# EAGLE design Blackfoot (EAGLE 8.5.1)

## Sheet 1 of 2
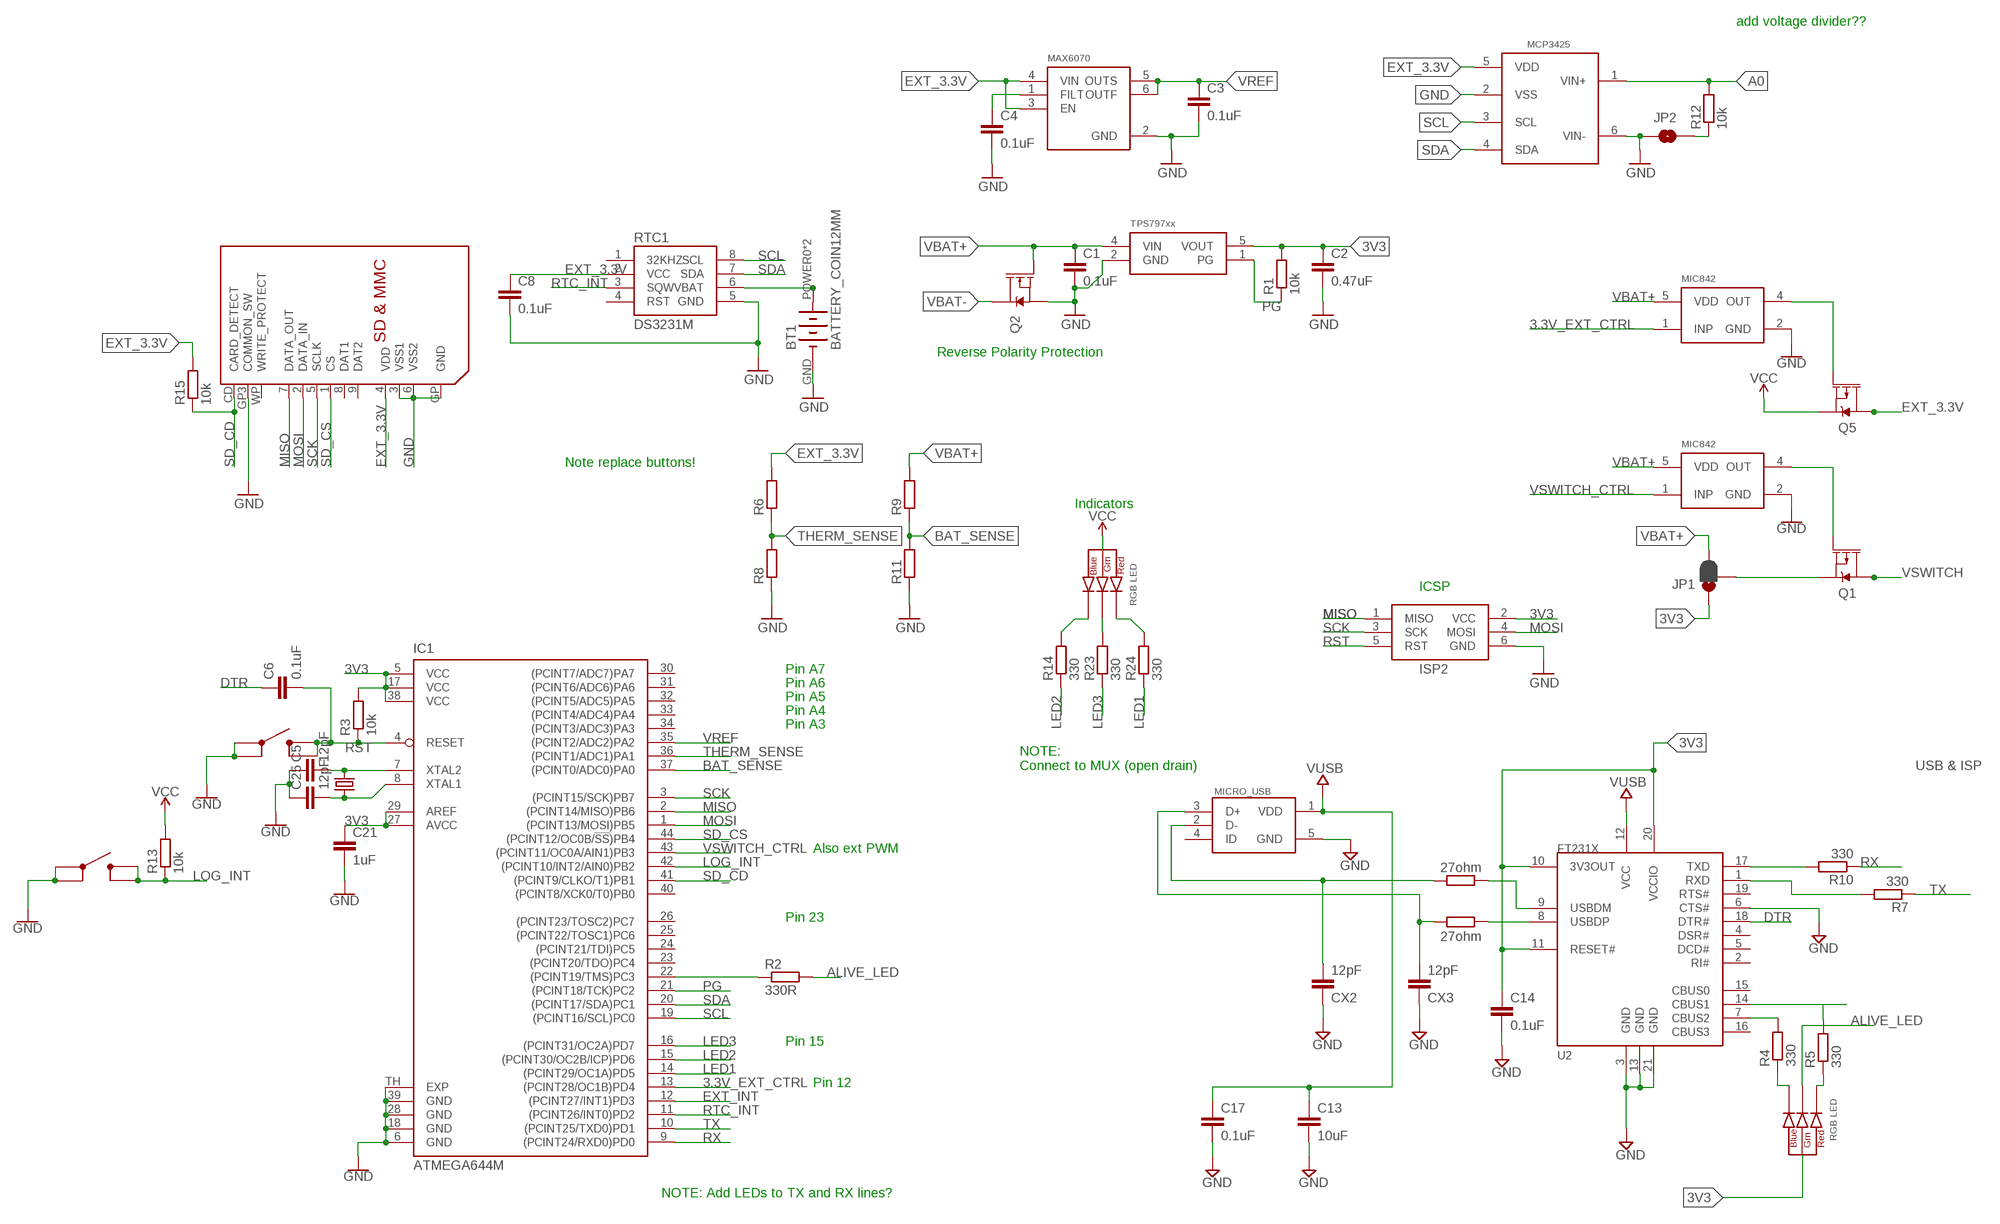
[diagram p0: schematic, sheet 1]

### Parts
BT1  BATTERY_COIN12MM  [AWICKERT_LINX_BAT-HLD-012-SMT]
C1  0.1uF  C-EUC0603  [C0603]
C2  0.47uF  C-EUC0603  [C0603]
C3  0.1uF  C-EUC0603  [C0603]
C4  0.1uF  C-EUC0603  [C0603]
C5  12pF  C-EU12PFC0603  [C0603]
C6  0.1uF  C-EU0.1UFC0603  [C0603]
C8  0.1uF  C-EUC0603  [C0603]
C13  10uF  C-EU10UFC0805  [C0805]
C14  0.1uF  C-EU0.1UFC0603  [C0603]
C17  0.1uF  C-EU0.1UFC0603  [C0603]
C21  1uF  C-EU1UFC0603  [C0603]
C25  12pF  C-EU12PFC0603  [C0603]
CX2  12pF  C-EU12PFC0603  [C0603]
CX3  12pF  C-EU12PFC0603  [C0603]
D+  27ohm  R-EU_27R0603  [R0603]
D-  27ohm  R-EU_27R0603  [R0603]
IC1  ATMEGA644M  [MLF44-TH]
ISP2  AVRISP-6  [AVRISP]
JP1  JUMPER-SMT_3_1-NC_PASTE_SILK  [SMT-JUMPER_3_1-NC_PASTE_SILK]
JP2  JUMPER-SMT_2_NO_SILK  [SMT-JUMPER_2_NO_SILK]
MICRO_USB  MICRO_USB_LONGPADS  [10118194-0001LF_10118194-0001LF_LONGER_PADS]
Q1  MOSFET_PCH-IRLML2244  [SOT23-3]
Q2  MOSFET-NCH-DMG3404L  [SOT23-3]
Q5  MOSFET_PCH-IRLML2244  [SOT23-3]
R1  10k  R-EU_R0603  [R0603]
R2  330R  R-EU_R0603  [R0603]
R3  10k  R-EU_10KR0603  [R0603]
R4  330  R-EU_330R0603  [R0603]
R5  330  R-EU_330R0603  [R0603]
R6  R-EU_R0603  [R0603]
R7  330  R-EU_330R0603  [R0603]
R8  R-EU_R0603  [R0603]
R9  R-EU_R0603  [R0603]
R10  330  R-EU_330R0603  [R0603]
R11  R-EU_R0603  [R0603]
R12  10k  R-EU_R0603  [R0603]
R13  10k  R-EU_10KR0603  [R0603]
R14  330  R-EU_330R0603  [R0603]
R15  10k  R-EU_R0603  [R0603]
R23  330  R-EU_330R0603  [R0603]
R24  330  R-EU_330R0603  [R0603]
RTC1  DS3231M  [SO08]
U2  FT231X-Q  [QFN20]
U$1  CRYSTAL_5X3.2_2LEAD  [CRYSTAL_5X3.2_2-SMD]
U$3  SDMMC06132  [06132]
U$4  MIC842  [DCK_R-PDSO-G5]
U$5  BUTTON4.2X3.2  [SWITCH_4.2X3.2]
U$6  TPS79733  [DCK_R-PDSO-G5]
U$7  MAX6070AAUT18  [SOT23-6L]
U$8  MCP3425  [SOT23-6L]
U$9  BUTTON4.2X3.2  [SWITCH_4.2X3.2]
U$15  CLVBA-FKA  [CLVBA-FKA]
U$16  CLVBA-FKA  [CLVBA-FKA]
U$18  MIC842  [DCK_R-PDSO-G5]

### Nets
3.3V_EXT_CTRL: IC1.13((PCINT28/OC1B)PD4) U$18.1(INP)
3V3: C2.1 C14.1 C21.1 IC1.5(VCC) IC1.17(VCC) IC1.27(AVCC) IC1.29(AREF) IC1.38(VCC) ISP2.2(VCC) JP1.1 Q5.2(S) R1.2 R3.2 R13.2 U2.10(3V3OUT) U2.11(RESET#) U2.20(VCCIO) U$6.5(VOUT) U$15.2(ANODE) U$16.2(ANODE) ; supply symbol labelled VCC
A0: R12.2 U$8.1(VIN+) ; also sheet 2
ALIVE_LED: R2.2 U$16.4(GREEN_CATH)
BAT_SENSE: IC1.37((PCINT0/ADC0)PA0) R9.1 R11.2
DTR: C6.1 U2.18(DTR#)
EXT_3.3V: C8.1 Q5.3(D) R6.2 R15.2 RTC1.2(VCC) U$3.4(VDD) U$7.3(EN) U$7.4(VIN) U$8.5(VDD) ; also sheet 2
EXT_INT: IC1.12((PCINT27/INT1)PD3) ; also sheet 2
GND: BT1.GND(-) C1.2 C2.2 C3.2 C4.2 C5.1 C8.2 C13.2 C14.2 C17.2 C21.2 C25.1 CX2.1 CX3.1 IC1.6(GND) IC1.18(GND) IC1.28(GND) IC1.39(GND) IC1.TH(EXP) ISP2.6(GND) JP2.1 MICRO_USB.5(GND) Q2.2(S) R8.1 R11.1 RTC1.5(GND) U2.3(GND) U2.6(CTS#) U2.13(GND) U2.21(GND) U$3.3(VSS1) U$3.6(VSS2) U$3.GP3(COMMON_SW) U$3.GP(GND) U$4.2(GND) U$5.1 U$5.2 U$6.2(GND) U$7.2(GND) U$8.2(VSS) U$8.6(VIN-) U$9.1 U$9.2 U$18.2(GND) ; also sheet 2
LED1: IC1.14((PCINT29/OC1A)PD5) R24.1
LED2: IC1.15((PCINT30/OC2B/ICP)PD6) R14.1
LED3: IC1.16((PCINT31/OC2A)PD7) R23.1
LOG_INT: IC1.42((PCINT10/INT2/AIN0)PB2) R13.1 U$5.3 U$5.4
MISO: IC1.2((PCINT14/MISO)PB6) ISP2.1(MISO) U$3.7(DATA_OUT) ; also sheet 2
MOSI: IC1.1((PCINT13/MOSI)PB5) ISP2.4(MOSI) U$3.2(DATA_IN) ; also sheet 2
N$1: IC1.22((PCINT19/TMS)PC3) R2.1
N$2: Q1.1(G) U$4.4(OUT)
N$3: JP1.2 Q1.2(S)
N$5: C5.2 IC1.7(XTAL2) U$1.OSC2
N$7: Q5.1(G) U$18.4(OUT)
N$8: C25.2 IC1.8(XTAL1) U$1.OSC1
N$9: R14.2 U$15.3(BLUE_CATH)
N$10: R23.2 U$15.4(GREEN_CATH)
N$11: C4.1 U$7.1(FILT)
N$13: JP2.2 R12.1
N$15: R24.2 U$15.1(RED_CATH)
N$16: R5.1 U$16.1(RED_CATH)
N$25: R10.2 U2.17(TXD)
N$26: R4.1 U$16.3(BLUE_CATH)
N$31: BT1.POWER0(+) BT1.POWER1(+) RTC1.6(VBAT)
N$35: R7.2 U2.1(RXD)
N$36: CX3.2 D+.2 MICRO_USB.3(D+)
N$37: CX2.2 D-.2 MICRO_USB.2(D-)
N$38: D+.1 U2.8(USBDP)
N$41: R4.2 U2.7(CBUS2)
N$43: R5.2 U2.14(CBUS1)
N$46: D-.1 U2.9(USBDM)
PG: IC1.21((PCINT18/TCK)PC2) R1.1 U$6.1(PG)
RST: C6.2 IC1.4(RESET) ISP2.5(RST) R3.1 U$9.3 U$9.4
RTC_INT: IC1.11((PCINT26/INT0)PD2) RTC1.3(SQW)
RX: IC1.9((PCINT24/RXD0)PD0) R10.1
SCK: IC1.3((PCINT15/SCK)PB7) ISP2.3(SCK) U$3.5(SCLK) ; also sheet 2
SCL: IC1.19((PCINT16/SCL)PC0) RTC1.8(SCL) U$8.3(SCL) ; also sheet 2
SD_CD: IC1.41((PCINT9/CLKO/T1)PB1) R15.1 U$3.CD(CARD_DETECT)
SD_CS: IC1.44((PCINT12/OC0B/!SS!)PB4) U$3.1(CS)
SDA: IC1.20((PCINT17/SDA)PC1) RTC1.7(SDA) U$8.4(SDA) ; also sheet 2
THERM_SENSE: IC1.36((PCINT1/ADC1)PA1) R6.1 R8.2
TX: IC1.10((PCINT25/TXD0)PD1) R7.1
VBAT+: C1.1 JP1.3 Q2.1(G) R9.2 U$4.5(VDD) U$6.4(VIN) U$18.5(VDD) ; also sheet 2
VBAT-: Q2.3(D) ; also sheet 2
VREF: C3.1 IC1.35((PCINT2/ADC2)PA2) U$7.5(OUTS) U$7.6(OUTF) ; also sheet 2
VSWITCH: Q1.3(D) ; also sheet 2
VSWITCH_CTRL: IC1.43((PCINT11/OC0A/AIN1)PB3) U$4.1(INP)
VUSB: C13.1 C17.1 MICRO_USB.1(VDD) U2.12(VCC)
Unconnected: IC1.23((PCINT20/TDO)PC4) IC1.24((PCINT21/TDI)PC5) IC1.25((PCINT22/TOSC1)PC6) IC1.26((PCINT23/TOSC2)PC7) IC1.30((PCINT7/ADC7)PA7) IC1.31((PCINT6/ADC6)PA6) IC1.32((PCINT5/ADC5)PA5) IC1.33((PCINT4/ADC4)PA4) IC1.34((PCINT3/ADC3)PA3) IC1.40((PCINT8/XCK0/T0)PB0) MICRO_USB.4(ID) RTC1.1(32KHZ) RTC1.4(RST) U2.2(RI#) U2.4(DSR#) U2.5(DCD#) U2.15(CBUS0) U2.16(CBUS3) U2.19(RTS#) U$3.8(DAT1) U$3.9(DAT2) U$3.WP(WRITE_PROTECT)

### Notes on the sheet
- add voltage divider??
- Reverse Polarity Protection
- Note replace buttons!
- Indicators
- ICSP
- Pin A7
- Pin A6
- Pin A5
- Pin A4
- Pin A3
- NOTE:
  Connect to MUX (open drain)
- USB & ISP
- Also ext PWM
- Pin 23
- Pin 15
- Pin 12
- NOTE: Add LEDs to TX and RX lines?

## Sheet 2 of 2
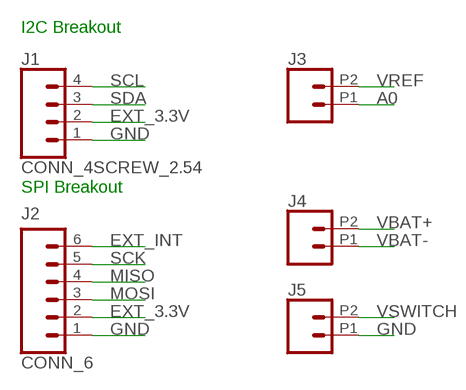
[diagram p1: schematic, sheet 2]

### Parts
J1  CONN_4SCREW_2.54  [1X04]
J2  CONN_6  [1X06_SCREW]
J3  CONN_022.54MM_SCREWTERM  [1X02_2.54_SCREWTERM]
J4  CONN_022.54MM_SCREWTERM  [1X02_2.54_SCREWTERM]
J5  CONN_022.54MM_SCREWTERM  [1X02_2.54_SCREWTERM]

### Nets
A0: J3.P1 ; also sheet 1
EXT_3.3V: J1.2 J2.2 ; also sheet 1
EXT_INT: J2.6 ; also sheet 1
GND: J1.1 J2.1 J5.P1 ; also sheet 1
MISO: J2.4 ; also sheet 1
MOSI: J2.3 ; also sheet 1
SCK: J2.5 ; also sheet 1
SCL: J1.4 ; also sheet 1
SDA: J1.3 ; also sheet 1
VBAT+: J4.P2 ; also sheet 1
VBAT-: J4.P1 ; also sheet 1
VREF: J3.P2 ; also sheet 1
VSWITCH: J5.P2 ; also sheet 1

### Notes on the sheet
- I2C Breakout
- SPI Breakout

## Library data of the parts
BT1 = bschulz:BATTERY_COIN: Coin Cell Battery Holder; DIGIKEY: BAT-HLD-012-SMT-ND; MF: Linx; MPN: BAT-HLD-012-SMT
C1-C4 = bschulz_passives:C-EU: CAPACITOR, European symbol
C5 C25 CX2 CX3 = bschulz:C-EU: CAPACITOR, European symbol; DIGIKEY: 1276-1254-1-ND; MF: Samsung; MPN: CL10C120JB8NNNC
C6 C14 C17 = bschulz:C-EU: CAPACITOR, European symbol; DIGIKEY: 1276-1005-1-ND; MF: Samsung; MPN: CL10B104KO8NNNC
C8 = bschulz:C-EU: CAPACITOR, European symbol
C13 = bschulz:C-EU: CAPACITOR, European symbol; DIGIKEY: 1276-2405-1-ND; MF: Samsung; MPN: CL21A106KQCLRNC
C21 = bschulz:C-EU: CAPACITOR, European symbol; DIGIKEY: 1276-6524-1-ND; MF: Samsung; MPN: CL10B105MO8NNWC
D+ D- = bschulz:R-EU_: RESISTOR, European symbol; DIGIKEY: 311-27.0HRCT-ND; MF: Yageo; MPN: RC0603FR-0727RL; VALUE_PART: 27
IC1 = bschulz:ATMEGA644*: 8-bit Microcontroller with 64K Bytes In-System Programmable Flash Source: http://www.atmel.com/dyn/resources/prod_documents/doc2593.pdf; DIGIKEY: ATMEGA644PA-MURCT-ND; MF: Atmel; MPN: ATMEGA644PA-MUR; OC_FARNELL: 1748528; OC_NEWARK: 26R5636
ISP2 = bschulz:AVRISP: AVR ISP HEADER Standard 6 pin header for AVR programming; DIGIKEY: 609-3234-ND; MF: Amphenol; MPN: 67997-206HLF
J1 = bschulz:CONN_4: Genaric 4 pin connector
J2 = bschulz:CONN_6: Genaric 6 pin header
J3-J5 = bschulz:CONN_02: Multi connection point. Often used as Generic Header-pin footprint for 0.1 inch spaced/style header connections On any of the 0.1 inch spaced packages, you can populate with these: Break Away Headers - Straight <https://www.sparkfun.com/products/116> (PRT-00116) Break Away Male Headers - Right Angle <https://www.sparkfun.com/products/553> (PRT-00553) Female Headers <https://www.sparkfun.com/products/115> (PRT-00115) Break Away Headers - Machine Pin <https://www.sparkfun.com/products/117> (PRT-00117) Break Away Female Headers - Swiss Machine Pin <https://www.sparkfun.com/products/743> (PRT-00743) For SCREWTERMINALS and SPRING TERMINALS visit here: Screw Terimnals on SparkFun.com <https://www.sparkfun.com/search/results?term=Screw+Terminals> (5mm/3.5mm/2.54mm spacing) This device is also useful as a general connection point to wire up your design to another part of your project. Our various solder wires solder well into these plated through hole pads. Hook-Up Wire - Assortment (Stranded, 22 AWG) <https://www.sparkfun.com/products/11375> (PRT-11375) Hook-Up Wire - Assortment (Solid Core, 22 AWG) <https://www.sparkfun.com/products/11367> (PRT-11367) View the entire wire category on our website here <https://www.sparkfun.com/categories/141> Special notes: Molex polarized connector foot print use with: PRT-08233 with associated crimp pins and housings. 2.54_SCREWTERM for use with PRT-10571. 3.5mm Screw Terminal footprints for PRT-08084 5mm Screw Terminal footprints for use with PRT-08432
JP1 = SparkFun-Jumpers:JUMPER-SMT_3_1-NC_PASTE: Normally closed solder jumper (1 of 2 connections) This jumper has an aperture in the stencil to allow solder paste to bridge one of the two connections. One connection is normally closed (NC), while the other is normally open (NO). Wick off the solder to open the connection. Reapply solder to reclose the connection. Apply solder to the other side instead to change the current path.
JP2 = SparkFun-Jumpers:JUMPER-SMT_2_NO: Normally open jumper This jumper has two pads in close proximity to each other. Apply solder to close the connection. Round pads are easier to solder for beginners, but are a lot larger. SparkFun Product that uses the round pads: SparkFun EL Sequencer <https://www.sparkfun.com/products/12781>
MICRO_USB = bschulz:MICRO_USB_LONGPADS
Q1 Q5 = bschulz:MOSFET_PCH: P-channel MOSFETs Voltage controlled devices that allow control of high current outputs. SparkFun Products: SparkFun ESP32 Thing <https://www.sparkfun.com/products/13907> SparkFun ESP8266 Thing <https://www.sparkfun.com/products/13231>; DIGIKEY: FDN360PCT-ND; MF: Fairchild; MPN: FDN360P
Q2 = bschulz:MOSFET-NCH: N-channel MOSFETs Voltage controlled devices that allow control of high current outputs. SparkFun Products: SparkFun OpenScale <https://www.sparkfun.com/products/13261> SparkFun Digital Sandbox <https://www.sparkfun.com/products/12651> SparkFun Monster Moto Shield <https://www.sparkfun.com/products/10182> SparkFun MOSFET Power Controller <https://www.sparkfun.com/products/11214>
R1 R2 R6 R8 R9 R11 R12 R15 = bschulz:R-EU_: RESISTOR, European symbol
R3 R13 = bschulz:R-EU_: RESISTOR, European symbol; DIGIKEY: 311-10.0KHRCT-ND; MF: Yageo; MPN: RC0603FR-0710KL; VALUE_PART: 10k
R4 R5 R7 R10 R14 R23 R24 = bschulz:R-EU_: RESISTOR, European symbol; DIGIKEY: 311-330HRCT-ND; MF: Yageo; MPN: RC0603FR-07330RL; VALUE_PART: 330
RTC1 = bschulz:DS3231M: DS3231M Real Time Clock Accuracy +/-5ppm. Battery Backup. 2.3V to 5.5V. Datasheet <https://cdn.sparkfun.com/datasheets/Dev/Beagle/DS3231M.pdf> SparkFun Products CryptoCape <https://www.sparkfun.com/products/12773> (DEV-12773) SparkFun CryptoShield <https://www.sparkfun.com/products/13183> (DEV-13183); DIGIKEY: DS3231MZ+-ND; MF: Maxim; MPN: DS3231MZ+
U2 = bschulz:FT231X: FT231x - USB to UART Bridge Characteristics: Vin: 3.3V ~ 5V Operating Temperature: -40°C to 85°C Digikey: FT231x <https://www.digikey.com/product-detail/en/ftdi-future-technology-devices-international-ltd/FT231XQ-R/768-1128-1-ND/3029153>; DIGIKEY: 768-1128-1-ND; MF: FTDI; MPN: FT231XQ-R
U$1 = bschulz:CRYSTAL_5X3.2_2LEAD: TXC Crystal, 5 x 3.2mm, SMD, 2 Lead 8 MHz PN = 887-2634-1-ND
U$3 = adafruit:SDMMC: SD MMC Card holder 4UCON part #06132 - easy to solder
U$4 U$18 = bschulz:MIC842: Comparator with internal voltage referance (1.24V), 5V and 3.3V compatable, 20mA output current
U$5 U$9 = bschulz:BUTTON: Genaric SPST Pushbutton
U$6 = bschulz:TPS797*: TPS797xx, Ultra low power linear voltage regulator, fixed voltages of 1.8v, 3v, 3.3v Input voltage rage of 1.8-5.5v; DIGIKEY: 296-11990-1-ND; MF: TI; MPN: TPS79733DCKR
U$7 = bschulz:MAX6070AAUT*: MAX6070 Low Noise high precision voltage referance; DIGIKEY: MAX6070BAUT18+TCT-ND; MF: Maxim; MPN: MAX6070BAUT18+T
U$8 = bschulz:MCP3425: MCP3425 - Sigma Delta ADC Characteristics: VCC: 2.7~5.5V Operating Temperature: -40°C to 125°C Number of Inputs: 1 (Differenital) Sample Rate: 15 Samples Per Second Number of Bits: 16 Digikey: MCP3425A0T-E/CHCT-ND <https://www.digikey.com/product-detail/en/microchip-technology/MCP3425A0T-E-CH/MCP3425A0T-E-CHCT-ND/1979810>; DIGIKEY: MCP3425A0T-E/CHCT-ND; MF: Microchip; MPN: MCP3425A0T-E/CH
U$15 U$16 = bschulz:CLVBA-FKA: Cree RGB LED, Small Package, Common Anode, CLVBA-FKA Digikey: https://www.digikey.com/product-detail/en/cree-inc/CLVBA-FKA-CAEDH8BBB7A363/CLVBA-FKA-CAEDH8BBB7A363CT-ND/2650500; DIGIKEY: CLVBA-FKA-CAEDH8BBB7A363CT-ND; MF: Cree; MPN: CLVBA-FKA-CAEDH8BBB7A363

## Board
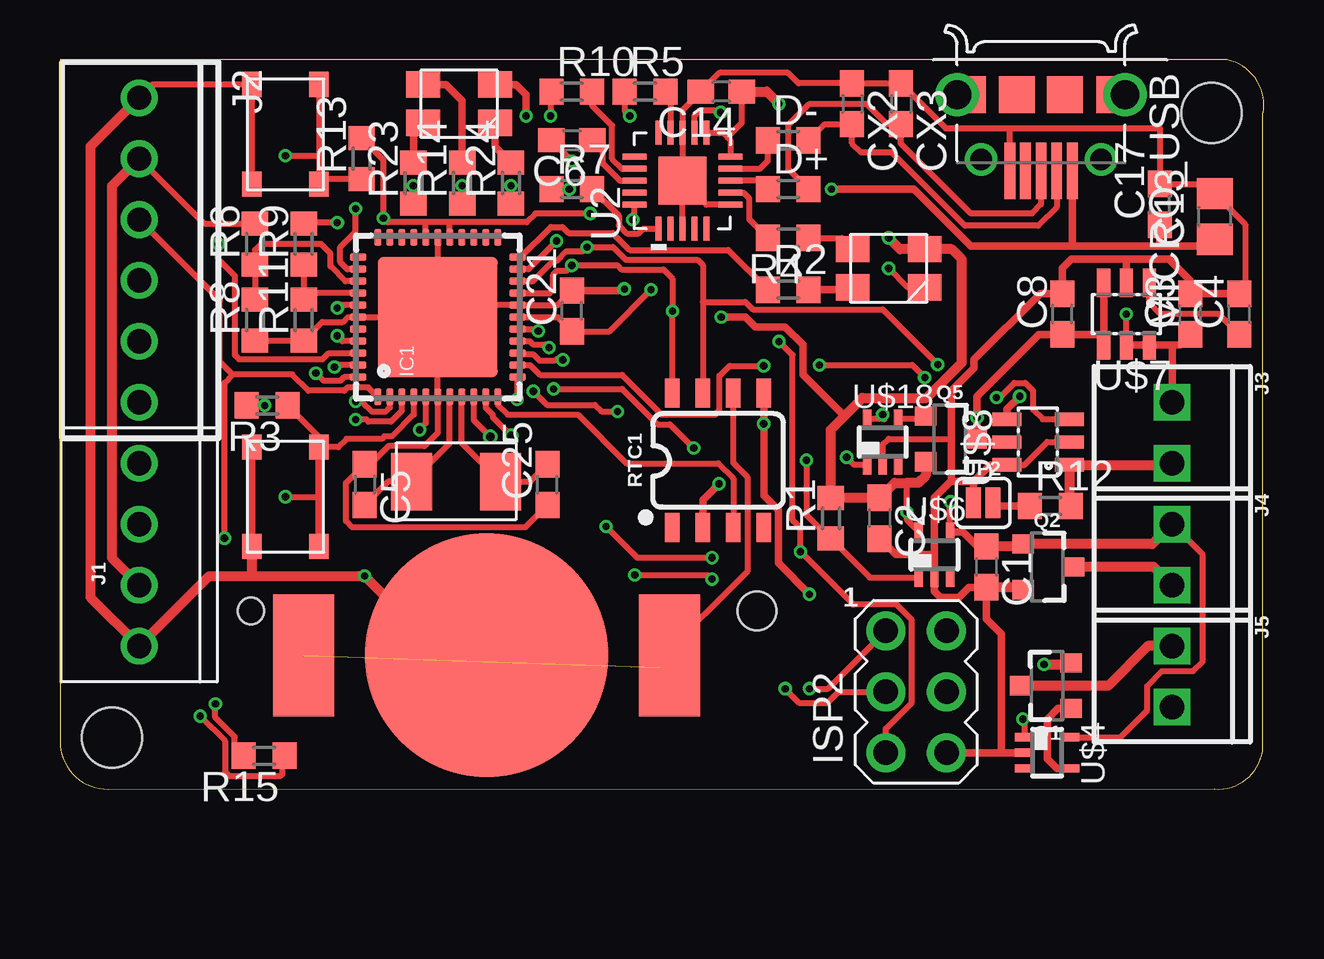
[diagram p2: board, top side]
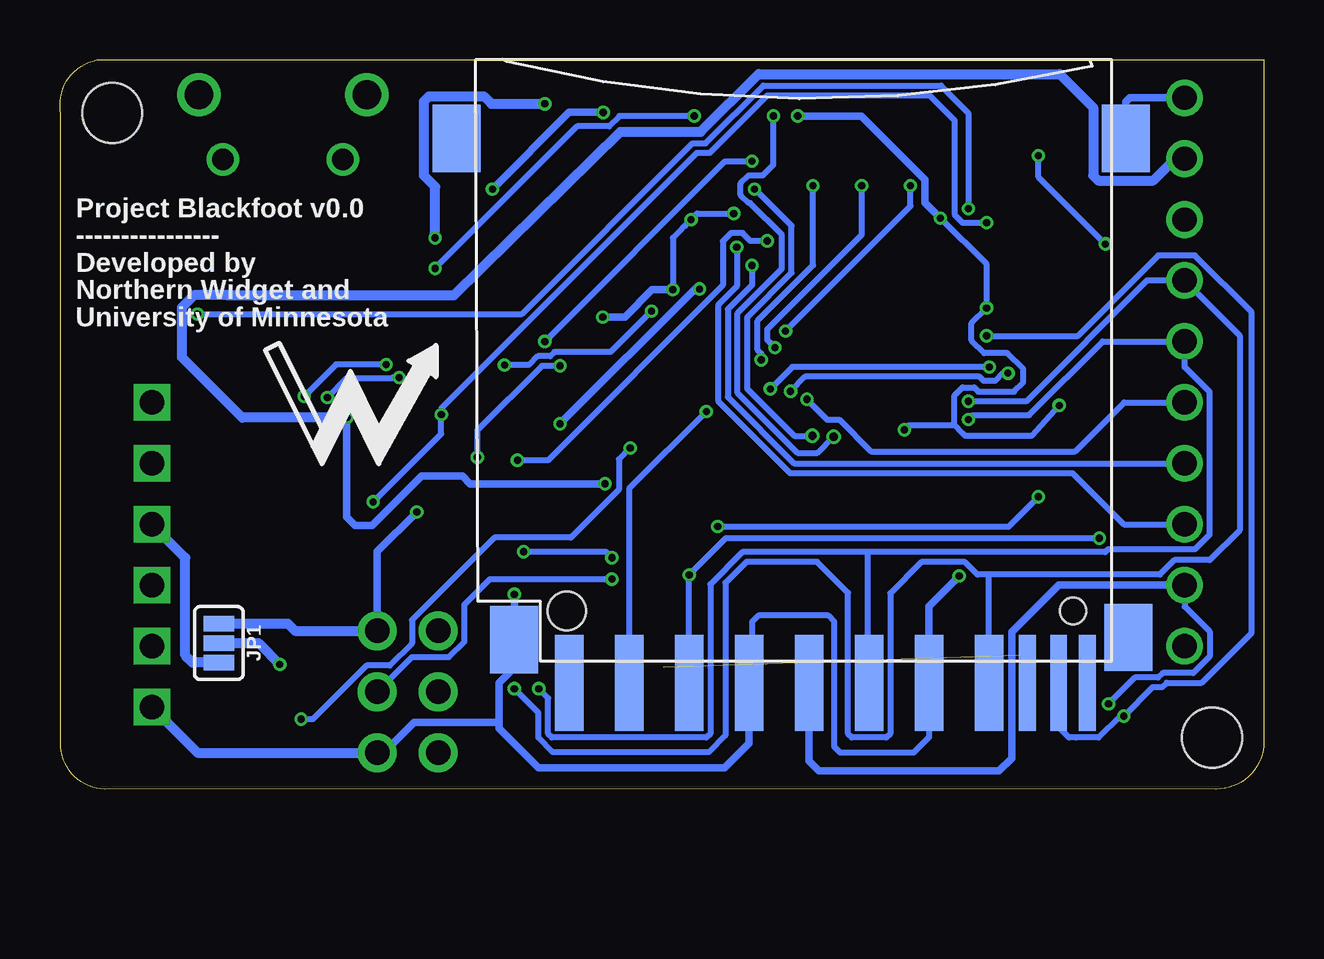
[diagram p3: board, bottom side, seen from below]

Size 50.18 x 30.4 mm. Coordinates in mm from the lower left corner, seen from the top.
Outline: 0,30.4 0,2 arc90 2,0 48.13,0.01 arc90 50.15,1.76 50.15,28.15 arc90 48.65,30.4 0,30.4
Copper layers (1*16): Top 0.035559375mm / dielectric 1.6mm / Bottom 0.035559375mm
Design rules "BayArea-2layer *": minimum track width 6mil, minimum drill 10mil, track to track 6mil, track to pad 6mil, pad to pad 6mil, via to via 6mil, smd to smd 6mil, copper to edge 15mil, drill to drill 6mil, minimum pad ring 5mil, minimum via ring 5mil, stop-mask expansion 2.5mil, vias tented up to drill 0mil, thermal gap 10mil
Holes 2.5 mm at 2.16,2.16 48.01,28.19
tKeepout: area 0.4,0.4 to 3.9,3.9; area 46.2,26.4 to 49.8,30

### Footprints (pad centres in the part's own frame; a part is rotated, then mirrored left to right if it is on the bottom)
AWICKERT_LINX_BAT-HLD-012-SMT = smd 10.16 x 10.16: GND 0,0 | smd 2.54 x 5.08: POWER0 -7.62,0; POWER1 7.62,0
C0603 = smd 1.1 x 1: 1 -0.85,0; 2 0.85,0
C0805 = smd 1.3 x 1.5: 1 -0.95,0; 2 0.95,0
R0603 = smd 1 x 1.1: 1 -0.85,0; 2 0.85,0
MLF44-TH = smd 0.7 x 0.3: 1 -3.325,2.5; 2 -3.325,2; 3 -3.325,1.5; 4 -3.325,1; 5 -3.325,0.5; 6 -3.325,0; 7 -3.325,-0.5; 8 -3.325,-1; 9 -3.325,-1.5; 10 -3.325,-2; 11 -3.325,-2.5; 23 3.325,-2.5; 24 3.325,-2; 25 3.325,-1.5; 26 3.325,-1; 27 3.325,-0.5; 28 3.325,0; 29 3.325,0.5; 30 3.325,1; 31 3.325,1.5; 32 3.325,2; 33 3.325,2.5 | smd 0.3 x 0.7: 12 -2.5,-3.325; 13 -2,-3.325; 14 -1.5,-3.325; 15 -1,-3.325; 16 -0.5,-3.325; 17 0,-3.325; 18 0.5,-3.325; 19 1,-3.325; 20 1.5,-3.325; 21 2,-3.325; 22 2.5,-3.325; 34 2.5,3.325; 35 2,3.325; 36 1.5,3.325; 37 1,3.325; 38 0.5,3.325; 39 0,3.325; 40 -0.5,3.325; 41 -1,3.325; 42 -1.5,3.325; 43 -2,3.325; 44 -2.5,3.325 | smd 5 x 5: TH 0,0
AVRISP = drill 1.02 pad 1.626: 1 -1.27,2.54; 2 1.27,2.54; 3 -1.27,0; 4 1.27,0; 5 -1.27,-2.54; 6 1.27,-2.54
1X04 = drill 1.016: 1 -3.81,0; 2 -1.27,0; 3 1.27,0; 4 3.81,0
1X06_SCREW = drill 1.016: 1 -6.35,0; 2 -3.81,0; 3 -1.27,0; 4 1.27,0; 5 3.81,0; 6 6.35,0
1X02_2.54_SCREWTERM = drill 1.016 square: P1 2.54,0; P2 0,0
SMT-JUMPER_3_1-NC_PASTE_SILK = smd 0.635 x 1.27: 1 -0.813,0; 2 0,0; 3 0.813,0
SMT-JUMPER_2_NO_SILK = smd 0.635 x 1.27: 1 -0.406,0; 2 0.406,0
10118194-0001LF_10118194-0001LF_LONGER_PADS = smd 0.45 x 2.35: 1 -1.3,3.175; 2 -0.65,3.175; 3 0,3.175; 4 0.65,3.175; 5 1.3,3.175 | drill 0.9: P$6 -2.5,2.7; P$7 2.5,2.7 | drill 1.2: P$8 -3.5,0; P$9 3.5,0 | smd 1.5 x 1.55: P$10 -1,0; P$11 1,0; P$12 -3.05,0; P$13 3.05,0
SOT23-3 = smd 0.8 x 0.9: 1 -0.95,-1; 2 0.95,-1; 3 0,1.1
SO08 = smd 0.6 x 1.2: 1 -1.905,-2.8; 2 -0.635,-2.8; 3 0.635,-2.8; 4 1.905,-2.8; 5 1.905,2.8; 6 0.635,2.8; 7 -0.635,2.8; 8 -1.905,2.8
QFN20 = smd 1 x 0.25: 1 -2.032,0.968; 2 -2.032,0.468; 3 -2.032,-0.032; 4 -2.032,-0.532; 5 -2.032,-1.032; 11 1.968,-1.032; 12 1.968,-0.532; 13 1.968,-0.032; 14 1.968,0.468; 15 1.968,0.968 | smd 0.25 x 1: 6 -1.032,-2.032; 7 -0.532,-2.032; 8 -0.032,-2.032; 9 0.468,-2.032; 10 0.968,-2.032; 16 0.968,1.968; 17 0.468,1.968; 18 -0.032,1.968; 19 -0.532,1.968; 20 -1.032,1.968 | smd 2 x 2: 21 -0.032,-0.032
CRYSTAL_5X3.2_2-SMD = smd 1.7 x 2.4: OSC1 -1.85,0; OSC2 1.85,0
06132 = smd 1.2 x 4: 1 6.9,0.9; 2 4.4,0.9; 3 1.9,0.9; 4 -0.6,0.9; 5 -3.1,0.9; 6 -5.6,0.9; 7 -8.1,0.9; 9 9.4,0.9 | smd 0.7 x 4: 8 -9.7,0.9; CD -11,0.9; WP -12.2,0.9 | smd 2 x 2.8: GP -13.8,-21.8; GP2 14.1,-21.8; GP3 11.7,-0.9; GP4 -13.9,-1 | hole 1.1: -11.6,-2.1 | hole 1.6: 9.5,-2.1
DCK_R-PDSO-G5 = smd 0.35 x 0.8: 1 -0.65,-0.95; 2 0,-0.95; 3 0.65,-0.95; 4 0.65,0.95; 5 -0.65,0.95
SWITCH_4.2X3.2 = smd 1.05 x 0.812: 1 -2.075,1.4; 2 2.075,1.4; 3 -2.075,-1.4; 4 2.075,-1.4
SOT23-6L = smd 0.55 x 1.2: 1 -0.95,-1.3; 2 0,-1.3; 3 0.95,-1.3; 4 0.95,1.3; 5 0,1.3; 6 -0.95,1.3
CLVBA-FKA = smd 1.4 x 1.1: 1 -1.5,0.8; 2 -1.5,-0.8; 3 1.5,-0.8; 4 1.5,0.8

### Placement (x,y rotation side)
BT1  17.78,5.59 180 top
C1  38.61,9.27 270 top
C2  34.16,11.3 270 top
C3  47.12,19.81 90 top
C4  49.15,19.81 90 top
C5  12.7,12.7 270 top
C6  21.34,27.05 180 top
C8  41.78,19.81 90 top
C13  48.13,23.88 90 top
C14  27.56,29.08 180 top
C17  45.85,24.38 90 top
C21  21.34,19.94 90 top
C25  20.32,12.7 90 top
CX2  33.02,28.57 270 top
CX3  35.05,28.57 270 top
D+  30.35,25.02 0 top
D-  30.35,27.05 0 top
IC1  15.75,19.68 90 top
ISP2  35.69,4.06 0 top
J1  3.3,9.78 90 top
J2  3.3,22.48 270 top
J3  46.35,16.13 270 top
J4  46.35,11.05 270 top
J5  46.35,5.97 270 top
JP1  43.56,6.1 270 bottom
JP2  38.48,11.94 0 top
MICRO_USB  40.89,28.96 180 top
Q1  41.15,4.32 90 top
Q2  41.15,9.27 270 top
Q5  37.08,14.61 270 top
R1  32.13,11.3 90 top
R2  30.35,20.83 0 top
R3  8.64,16 180 top
R4  30.35,22.99 180 top
R5  24.38,29.08 0 top
R6  8.13,22.73 90 top
R7  21.34,25.02 0 top
R8  8.13,19.56 90 top
R9  10.16,22.73 90 top
R10  21.34,29.08 0 top
R11  10.16,19.56 90 top
R12  41.27,11.81 0 top
R13  12.57,26.29 90 top
R14  16.76,25.27 90 top
R15  8.51,1.4 180 top
R23  14.73,25.27 90 top
R24  18.8,25.27 90 top
RTC1  27.43,13.72 0 top
U2  25.91,25.4 90 top
U$1  16.51,12.83 180 top
U$2  [NWLOGO_MED]  38.1,16.51 0 bottom
U$3  19.56,5.33 180 bottom
U$4  41.15,1.52 270 top
U$5  9.4,27.3 90 top
U$6  36.45,9.78 0 top
U$7  44.45,19.81 180 top
U$8  40.77,14.48 90 top
U$9  9.4,12.19 90 top
U$15  16.64,28.57 180 top
U$16  34.54,21.72 180 top
U$18  34.29,14.48 0 top

### Tracks (layer width: path | path; a pad name or v marks a point on that pad's centre or on a via)
3.3V_EXT_CTRL  (via drill 0.3)
  Top 0.254: IC1.13 19.6,17.68 20.02,17.27 23.43,17.27 25.08,15.62 27.31,15.62 27.49,15.8 27.49,17.23 27.91,17.65 v29.34,17.65 | U$18.1 33.1,13.53 v32.79,13.84
  Bottom 0.254: v32.79,13.84 32.79,14.96 30.1,17.65 v29.34,17.65
3V3  (via drill 0.3)
  Top 0.254: U2.11 27.62,27.37 27.81,27.18 | 27.81,27.18 27.94,27.05 U2.10 | C14.1 28.41,27.77 27.81,27.18 | IC1.17 20.74,19.68 C21.1 22.9,19.09 v24.64,20.83 | IC1.38 11.68,20.18 v11.56,20.07 | R3.2 v8.53,16 | 15.24,23.64 13.66,23.64 v13.48,23.81 13.48,26.23 R13.2 | IC1.29 15.25,23.63 15.24,23.64 | v23.88,23.75 23.94,23.81 U2.20 | v22.1,24 19.82,24 19.46,23.64 16.26,23.64 | 16.26,23.64 15.24,23.64 | IC1.27 16.25,23.63 16.26,23.64 | U$6.5 35.31,11.22 v35.31,11.56 35.31,12.77 | IC1.5 15.25,15.25 v14.99,14.99
  Top 0.305: v19.43,28.07 19.43,28.96 19.01,29.38 U$15.2 | 32.7,15.56 30.96,17.3 30.96,18.53 30.22,19.28 28.98,19.28 28.57,19.68 v27.56,19.68
  Top 0.406: v34.54,22.99 35.01,22.52 U$16.2 37.17,22.52 37.59,22.1 37.59,17.78 36.12,16.31 33.45,16.31 32.7,15.56 32.13,15 R1.2 C2.1 34.78,12.77 35.31,12.77 35.77,12.77 36.08,13.09 Q5.2 | C14.1 29.46,29.08 v29.97,28.57
  Bottom 0.254: v8.53,16 9.68,14.73 12.45,14.73 12.55,14.84 12.56,14.84 12.9,15.18 | 12.9,15.18 12.9,16.41 12.56,16.76 12.08,16.76 11.9,16.58 10.41,16.58 10.03,16.96 10.03,17.53 10.68,18.18 11.66,18.18 12.19,18.72 12.19,19.43 v11.56,20.07 11.56,21.89 v13.48,23.81 | v14.99,14.99 14.79,15.18 12.9,15.18 | 24.13,23.5 v23.88,23.75 | v23.88,23.75 23.62,24 v22.1,24 | v23.88,23.75 24.64,22.99 v24.64,20.83
  Bottom 0.305: v35.31,11.56 36.96,9.91 ISP2.2 | v13.48,23.81 14.12,24.46 14.12,25.42 16.77,28.07 v19.43,28.07 | v27.56,19.68 26.64,19.68 25.5,20.83 v24.64,20.83
  Bottom 0.406: v29.97,28.57 32.2,28.57 32.51,28.89 34.8,28.89 35.01,28.68 35.01,25.59 34.54,25.12 v34.54,22.99 | JP1.1 40.69,6.91 40.39,6.6 ISP2.2
A0
  Top 0.406: R12.2 42.07,11.87 U$8.1 46.29,13.53 J3.P1
ALIVE_LED
  Top 0.305: R2.2 32.95,20.83 U$16.4
BAT_SENSE
  Top 0.254: R9.1 R11.2 10.44,20.68 IC1.37
DTR
  Top 0.254: C6.1 22.61,26.63 22.61,26.1 23.34,25.37 U2.18
EXT_3.3V  (via drill 0.3)
  Top 0.254: J2.2 6.01,23.58 R6.2 | R15.2 7.29,1.77 7.29,2.18 6.48,2.99 v6.48,3.56
  Top 0.305: U$7.3 43.5,19.05 | 43.5,19.05 U$7.4 | v27.46,12.73 26.8,12.06 RTC1.2 | U$8.5 38.31,14.48 38.23,14.56 | 38.23,14.56 Q5.3 | 38.23,14.56 v38.23,15.49 38.23,16.38 40.81,18.96 C8.1 43.41,18.96 43.5,19.05
  Top 0.406: J2.2 2.16,25.15 2.16,9.65 J1.2
  Bottom 0.254: v6.48,3.56 5.38,4.66 4.42,4.66 4.22,4.85 2.95,4.85 2.26,5.54 2.26,6.58 3.3,7.62 J1.2
  Bottom 0.305: J1.2 7.5,8.51 7.51,8.52 8.56,8.52 10.51,6.56 10.51,1.3 11.05,0.76 18.54,0.76 18.96,1.18 U$3.4 | v27.46,12.73 33.08,12.73 33.4,13.05 35.1,13.05 37.16,10.99 37.89,10.99 38.24,11.35 38.24,15 v38.23,15.49
  Bottom 0.406: J2.2 3.7,26.29 4.61,25.38 6.91,25.38 7.11,25.59 7.11,28.42 8.51,29.82 21.07,29.82 23.48,27.41 26.82,27.41 33.76,20.6 43.18,20.6 43.2,20.6 44.59,20.6 45.11,20.08 45.11,18.02 42.59,15.49 v38.23,15.49
EXT_INT  (via drill 0.3)
  Top 0.254: IC1.12 19.05,17.16 v19.05,16.26
  Bottom 0.254: J2.6 5.82,16.13 7.86,14.09 16.37,14.09 17.7,15.41 18.2,15.41 v19.05,16.26
GND  (via drill 0.3)
  Top 0.254: U$8.2 41.15,14.48 40.2,13.53 U$8.6 | U2.3 U2.21 | U2.6 26.94,24.37 U2.21 | U2.21 U2.13 25.94,28.31 C14.2 27.49,29.86 30.34,29.86 30.78,29.43 CX2.1 CX3.1 36.92,27.56 39.59,27.56 | 39.59,27.56 45.85,27.56 C17.2 47.73,25.23 C13.2 49.4,23.56 49.4,20.92 C4.2 | MICRO_USB.5 39.59,27.56 | C25.1 19.39,10.92 12.18,10.92 11.92,11.18 11.92,12.77 12.59,13.44 | 12.59,13.44 C5.1 | IC1.TH IC1.6 15.75,14.86 15.2,14.31 13.69,14.31 12.83,13.44 12.59,13.44 | IC1.TH 16.25,20.18 IC1.18 20.73,20.18 C21.2 | IC1.TH IC1.39 12,19.68 11.8,19.48 10.94,19.48 R11.1 R8.1 | IC1.28 IC1.TH | J2.1 3.85,29.38 U$5.2 U$5.1 | U$18.2 34.29,14.35 34.54,14.61 37.15,14.61
  Top 0.305: U$4.2 39.24,1.52 | 39.24,1.52 ISP2.6 | C4.2 C3.2 47.12,21.21 46.23,22.1 44.45,22.1 | 44.45,21.34 U$7.2 44.45,22.1 | U$9.2 U$9.1 | v31.24,8.13 29.94,9.43 29.94,11.64 29.34,12.25 v29.34,15.24 RTC1.5 | v23.52,20.86 23.46,20.79 C21.2 | 36.45,9.78 U$6.2 36.45,8.26 36.7,8 37.47,8 37.88,8.42 C1.2 38.61,7.11 39.24,6.48 39.24,1.52 | C2.2 34.84,9.78 36.45,9.78 | 36.45,9.78 36.45,12.16 37.12,12.83 | 38.08,12.83 JP2.1 | 37.12,12.83 38.08,12.83 | U$8.6 38.78,13.53 38.08,12.83 | 37.12,12.83 37.15,12.86 37.15,14.61 37.15,16.62 38.1,17.57 38.1,17.91 40.85,20.66 C8.2 41.78,21.72 42.16,22.1 44.45,22.1
  Top 0.406: J2.1 1.27,26.8 1.27,8 J1.1 6.22,8.89 8,8.89 | 8,8.89 v12.7,8.89 16,5.59 BT1.GND | U$9.1 8,8.89 | Q2.2 40.05,8.42 C1.2
  Bottom 0.254: U$3.6 13.96,2.17 14.61,1.52 17.65,1.52 17.91,1.78 17.91,6.99 18.16,7.24 21.07,7.24 21.33,6.98 21.33,4.56 U$3.3
  Bottom 0.305: J2.1 5.59,28.83 5.76,28.66 U$3.GP | 31.24,6.25 U$3.GP3 31.11,6.09 | 31.24,6.25 v31.24,8.13 | U$3.6 13.96,7.63 v12.7,8.89 | U$3.3 21.46,1.91 22.48,0.89 30.23,0.89 31.88,2.54 31.88,2.79 | ISP2.6 36.7,1.52 35.43,2.79 31.88,2.79 | 31.88,2.79 31.88,4.45 31.24,5.08 31.24,6.25 | v29.34,15.24 23.72,20.86 v23.52,20.86
  Bottom 0.406: J5.P1 44.45,1.52 ISP2.6
LED1  (via drill 0.3)
  Top 0.254: v18.8,25.17 R24.1 | v20.95,17.91 20.66,17.91 20.61,17.86 20,17.86 19.75,18.11 19.14,18.11 IC1.14
  Bottom 0.254: v20.95,17.91 20.95,18.17 21.11,18.32 21.11,19.53 18.8,21.84 v18.8,25.17
LED2  (via drill 0.3)
  Top 0.254: v16.76,25.17 R14.1 | IC1.15 19.57,18.68 19.71,18.55 20.25,18.55 v20.38,18.41
  Bottom 0.254: v20.38,18.41 20.7,18.73 20.7,19.18 16.76,23.11 v16.76,25.17
LED3  (via drill 0.3)
  Top 0.254: IC1.16 19.86,19.18 v19.94,19.1 | v14.73,25.17 R23.1
  Bottom 0.254: v19.94,19.1 14.73,24.31 v14.73,25.17
LOG_INT  (via drill 0.3)
  Top 0.254: v6.6,22.73 6.6,22.1 7.3,21.4 7.3,18.09 7.46,17.93 10.94,17.93 11.2,18.18 IC1.42 | R13.1 10.84,25.44 10.8,25.4 U$5.3 10.8,26.42 | U$5.4 10.8,26.42 | v9.4,26.42 10.8,26.42
  Bottom 0.254: v6.6,22.73 9.4,25.53 v9.4,26.42
MISO  (via drill 0.3)
  Top 0.254: v31.24,4.19 32,4.19 ISP2.1 | IC1.2 13.75,15.91 13.57,15.73 13.03,15.73 12.58,16.17 v12.32,16.17
  Bottom 0.254: v12.32,16.17 9.91,16.17 4.87,21.21 J2.4 1.02,18.92 1.02,10.79 2.26,9.55 3.73,9.55 4.33,8.95 11.43,8.95 | 11.43,8.95 11.94,8.95 12.46,9.47 14.28,9.47 15.58,8.17 15.58,2.32 15.74,2.15 17.17,2.15 17.34,2.32 17.34,8.19 18.62,9.48 21.57,9.48 22.45,8.6 22.45,2.24 23.14,1.55 29.64,1.55 30.24,2.15 30.24,3.19 v31.24,4.19 | 11.43,8.95 11.46,8.92 U$3.7
MOSI  (via drill 0.3)
  Top 0.254: 7.21,17.29 6.66,17.84 6.66,20.39 J2.3 | IC1.1 12.85,16.76 11.99,16.76 11.85,16.62 10.36,16.62 9.69,17.29 7.21,17.29 | v6.86,10.47 6.86,16.94 7.21,17.29 | v23.96,8.94 27.01,8.94 v27.18,8.76
  Bottom 0.254: U$3.2 v23.96,8.94 22.43,10.47 v6.86,10.47 | v27.18,8.76 32.26,8.76 33.33,7.7 33.33,6.15 33.97,5.51 35.51,5.51 ISP2.4
N$1
  Top 0.254: R2.1 27.85,22.48 23.75,22.48 23.04,23.19 21.2,23.19 20.94,23.44 20.46,23.44 19.2,22.18 IC1.22
N$2
  Top 0.305: U$4.4 41.54,0.87 41.15,1.27 41.15,2.92 41.59,3.37 Q1.1
N$3  (via drill 0.3)
  Top 0.305: 42.21,5.21 Q1.2
  Top 0.406: v41.02,5.21 42.21,5.21
  Bottom 0.406: JP1.2 41.91,6.1 v41.02,5.21
N$5
  Top 0.254: IC1.7 16.25,14.41 U$1.OSC2 13.68,12.83 C5.2
N$7
  Top 0.254: Q5.1 35.96,15.43 U$18.4
N$8
  Top 0.254: IC1.8 16.75,14.44 U$1.OSC1 19.6,12.83 C25.2
N$9
  Top 0.305: R14.2 16.76,28.7 16.09,29.38 U$15.3
N$10
  Top 0.305: R23.2 14.73,27.37 U$15.4
N$11
  Top 0.254: C4.1 48.3,19.81 45.85,19.81 45.4,20.26 U$7.1
N$13
  Top 0.305: R12.1 39.01,11.81 JP2.2
N$15
  Top 0.305: R24.2 18.14,26.78 U$15.1
N$16  (via drill 0.3)
  Top 0.254: R5.1 23.53,28.28 v23.75,28.07 | 35.98,20.79 U$16.1 35.34,20.92 v34.54,21.72
  Bottom 0.254: v23.75,28.07 26.86,28.07 27.3,27.64 28.62,27.64 v34.54,21.72
N$25
  Top 0.254: R10.2 22.19,28.5 23.02,27.67 23.02,26.27 23.42,25.87 U2.17
N$26
  Top 0.254: R4.1 32.57,22.99 U$16.3
N$31  (1 unrouted)
  Top 0.254: RTC1.6 28.07,13.61 28.65,13.03 28.65,9.09 25.02,5.46 25.02,5.08 BT1.POWER0
N$35
  Top 0.254: R7.2 23.3,23.91 23.3,23.51 23.64,23.17 24.12,23.17 24.32,23.37 U2.1
N$36
  Top 0.254: D+.2 30.35,25.87 30.35,27.69 31.22,28.55 33.64,28.55 34.47,27.73 CX3.2 | 35.05,28.07 CX3.2 | MICRO_USB.3 40.89,24.38 40.51,24 37.97,24 35.05,26.92 CX3.2
N$37
  Top 0.254: MICRO_USB.2 41.54,24.27 40.77,23.5 37.72,23.5 34.67,26.54 33.4,26.54 33.02,26.92 CX2.2 31.88,27.73 D-.2
N$38
  Top 0.254: D+.1 29.15,25.37 U2.8
N$41
  Top 0.254: U2.7 28.49,24.87 28.72,24.64 28.72,23.77 R4.2
N$43
  Top 0.254: R5.2 25.44,28.88 U2.14
N$46
  Top 0.254: U2.9 29.17,25.87 29.5,26.2 D-.1
PG  (via drill 0.3)
  Top 0.254: v31.11,13.72 31.11,11.43 32.09,10.45 R1.1 33.76,8.83 U$6.1 | v20.7,22.86 19.53,21.68 IC1.21
  Bottom 0.254: v31.11,13.72 29.84,13.72 22.55,21.01 22.55,22.85 22.21,23.19 21.73,23.19 21.4,22.86 v20.7,22.86
RST  (via drill 0.3)
  Top 0.254: R3.1 10.8,14.69 U$9.4 11.6,14.27 11.94,14.61 13.42,14.61 13.53,14.71 13.84,14.71 14.75,15.62 IC1.4 | ISP2.5 34.42,2.52 35.51,3.61 35.51,7.06 34.87,7.7 33.07,7.7 v30.86,9.91 30.86,10.89 30.53,11.22 30.53,18.11 v29.97,18.67 | v27.18,9.65 24.06,9.65 v22.76,10.95 | v9.4,12.19 10.8,12.19 | v21.34,26.18 20.49,27.03 C6.2
  Top 0.305: U$9.4 10.8,12.19 U$9.3
  Bottom 0.254: v30.86,9.91 27.43,9.91 v27.18,9.65 | v22.76,10.95 10.64,10.95 v9.4,12.19 | v29.97,18.67 22.46,26.18 v21.34,26.18
RTC_INT
  Top 0.254: IC1.11 18.25,16.04 18.67,15.62 21.59,15.62 23.62,13.59 27.43,13.59 28.07,12.95 RTC1.3
RX  (via drill 0.3, 0.35)
  Top 0.254: IC1.9 17.25,15.39 v17.94,14.7 | R10.1 20.45,29.04 v20.45,28.07
  Bottom 0.254: v20.45,28.07 20.45,26.04 20.88,25.6 21.47,25.6 21.81,25.26 21.81,24.78 21.47,24.44 21.41,24.44 20.09,23.11 20.09,21.7 21.94,19.85 21.94,16.52 19.44,14.02 18.61,14.02 v17.94,14.7
SCK  (via drill 0.3)
  Top 0.254: ISP2.3 32.45,4.06 32,3.61 30.81,3.61 v30.23,4.19 | IC1.3 14.25,15.77 13.8,15.32 12.86,15.32 12.76,15.42 v12.32,15.42
  Bottom 0.254: v12.32,15.42 12.14,15.59 9.79,15.59 6.72,18.67 J2.5 3.3,17.6 2.26,16.56 2.26,10.62 2.87,10.01 6.5,10.01 6.62,9.89 16.51,9.89 | 16.51,9.89 21.74,9.89 23.08,8.54 23.08,2.32 23.24,2.15 29.67,2.15 29.84,2.32 29.84,3.8 v30.23,4.19 | U$3.5 16.51,4.49 16.51,9.89
SCL  (via drill 0.3)
  Top 0.254: IC1.19 20.41,20.68 20.56,20.83 20.56,21.45 20.72,21.62 21.11,21.62 v21.34,21.84 23.23,21.84 23.41,21.67 25.15,21.67 25.53,21.29 v25.53,19.94 RTC1.8 | v31.66,17.69 35.53,17.69 v36.05,17.16 | v39.04,16.34 39.17,16.34 39.77,16.94 40.23,16.94 40.56,16.61 40.56,15.83 40.96,15.43 U$8.3
  Bottom 0.254: v21.34,21.84 21.34,21.03 22.35,20.02 22.35,16.36 19.58,13.59 J1.4 | v31.66,17.69 30.64,17.69 30.27,18.06 29.75,18.06 29.58,18.23 27.23,18.23 v25.53,19.94 | v36.05,17.16 36.31,17.16 36.35,17.12 38.25,17.12 v39.04,16.34
SD_CD  (via drill 0.3)
  Top 0.254: IC1.41 11.78,18.68 v11.56,18.9 | v5.84,3.05 6.88,2.01 6.88,0.73 7.04,0.57 9.2,0.57 9.27,0.64 9.27,1.31 R15.1
  Bottom 0.254: v11.56,18.9 7.75,18.9 4.41,22.25 2.87,22.25 0.51,19.89 0.51,6.53 2.59,4.45 4.05,4.45 4.25,4.25 4.64,4.25 v5.84,3.05 6,3.05 6.89,2.15 7.82,2.15 7.83,2.16 8.13,2.16 8.56,2.59 U$3.CD
SD_CS  (via drill 0.3)
  Top 0.254: IC1.44 11.84,17.18 11.68,17.02 10.99,17.02 v10.67,17.35 | v19.73,16.59 20.29,16.03 22.29,16.03 22.57,15.75 v23.24,15.75
  Bottom 0.254: v10.67,17.35 10.88,17.35 11.2,17.02 11.68,17.02 11.86,17.2 19.12,17.2 v19.73,16.59 | v23.24,15.75 26.46,12.53 U$3.1
SDA  (via drill 0.3)
  Top 0.254: IC1.20 19.71,21.18 20.55,22.02 20.7,22.02 21.09,22.43 21.79,22.43 v21.97,22.61 23.05,22.61 23.58,22.07 26.57,22.07 26.8,21.84 26.8,20.32 | 26.8,20.32 RTC1.7 | 26.8,20.32 28.57,20.32 28.89,20 34.3,20 v36.59,17.71
  Top 0.305: v40.01,16.38 39.47,15.85 U$8.4
  Bottom 0.254: v21.97,22.61 21.97,20.97 22.76,20.18 22.76,16.19 19.75,13.18 7.98,13.18 5.84,11.05 J1.3 | v36.59,17.71 38.68,17.71 v40.01,16.38
THERM_SENSE
  Top 0.254: R8.2 R6.1 8.13,22.48 8.38,22.73 10.88,22.73 11.28,22.33 11.28,21.8 11.89,21.18 IC1.36
TX  (via drill 0.3, 0.35)
  Top 0.254: v21.23,25.02 R7.1 | IC1.10 17.75,15.91 18.03,15.62 18.03,15.52 v18.82,14.73
  Bottom 0.254: v21.23,25.02 21.21,25.02 19.68,23.5 19.68,21.53 21.54,19.68 21.54,16.69 19.58,14.73 v18.82,14.73
VBAT+  (via drill 0.3)
  Top 0.254: v34.29,15.62 34.35,15.43 U$18.5 | v11.56,23.62 10.2,23.62 R9.2 | U$6.4 37.1,11.95 v37.13,11.98 | U$4.5 44.2,2.17 45.31,3.29 45.31,4.31 45.93,4.93 47.23,4.93 47.62,5.32 47.62,9.78 J4.P2
  Top 0.305: U$6.4 37.64,10.73 38.24,10.12 C1.1
  Top 0.406: Q2.1 40.05,10.12 C1.1 | 40.34,10.03 Q2.1 | J4.P2 45.53,10.22 Q2.1
  Bottom 0.254: v11.56,23.62 12.56,23.62 12.9,23.96 12.9,27.89 13.95,28.93 20.7,28.93 23.11,26.52 23.64,26.52 34.29,15.88 v34.29,15.62 34.29,14.82 v37.13,11.98
  Bottom 0.406: JP1.3 44.65,5.28 44.96,5.59 44.96,9.65 J4.P2
VBAT-
  Top 0.406: J4.P1 45.59,9.27 Q2.3
VREF  (via drill 0.3)
  Top 0.254: U$7.5 v44.45,19.81 | IC1.35 11.97,21.68 11.68,21.97 11.68,22.61 12.32,23.24 v12.32,24.2
  Top 0.305: U$7.5 U$7.6 46.35,18.51 | 46.35,18.51 46.67,18.51 C3.1 | J3.P2 46.35,18.51
  Bottom 0.254: v44.45,19.81 30.93,19.81 23.81,26.93 23.28,26.93 20.87,29.34 13.46,29.34 12.32,28.19 v12.32,24.2
VSWITCH
  Top 0.406: J5.P2 45.34,5.97 43.69,4.32 Q1.3
VSWITCH_CTRL  (via drill 0.3)
  Top 0.254: IC1.43 11.52,17.68 v11.44,17.6 | v20.57,16.69 23.43,16.69 24.91,15.21 25.43,15.21 v26.42,14.22 | v40.13,2.92 40.2,2.85 U$4.1
  Bottom 0.254: v11.44,17.6 19.66,17.6 v20.57,16.69 | v26.42,14.22 26.88,13.76 26.88,12.49 28.89,10.49 32.08,10.49 35.51,7.06 35.51,6.09 36.44,5.16 37.41,5.16 39.65,2.92 v40.13,2.92
VUSB  (via drill 0.3)
  Top 0.254: U2.12 26.44,28.07 26.67,28.3 27.45,28.3 v27.54,28.22
  Top 0.305: v32.16,25.02 35.58,25.02 37.96,22.64 42.19,22.64 | 42.19,22.64 MICRO_USB.1 | 42.19,22.64 45.85,22.64 | 45.85,22.64 47.85,22.64 C13.1 | C17.1 45.85,22.64
  Bottom 0.305: v32.16,25.02 28.96,28.22 v27.54,28.22

### Text on the board
bPlace: Project Blackfoot v0.0 / ---------------- / Developed by / Northern Widget and / University of Minnesota
tDocu: LOG | STAT | AUX | J0 | RST
bDocu: GND | 3v3 | DO | DI | SCK | CS | REF | SCL | Ax | SDA | B+ | 3v3 | B- | 3v3 | GND | J1 | Vs | VBat | GND